# EAGLE schematic MicroBit_Breakout (EAGLE 7.3.0)
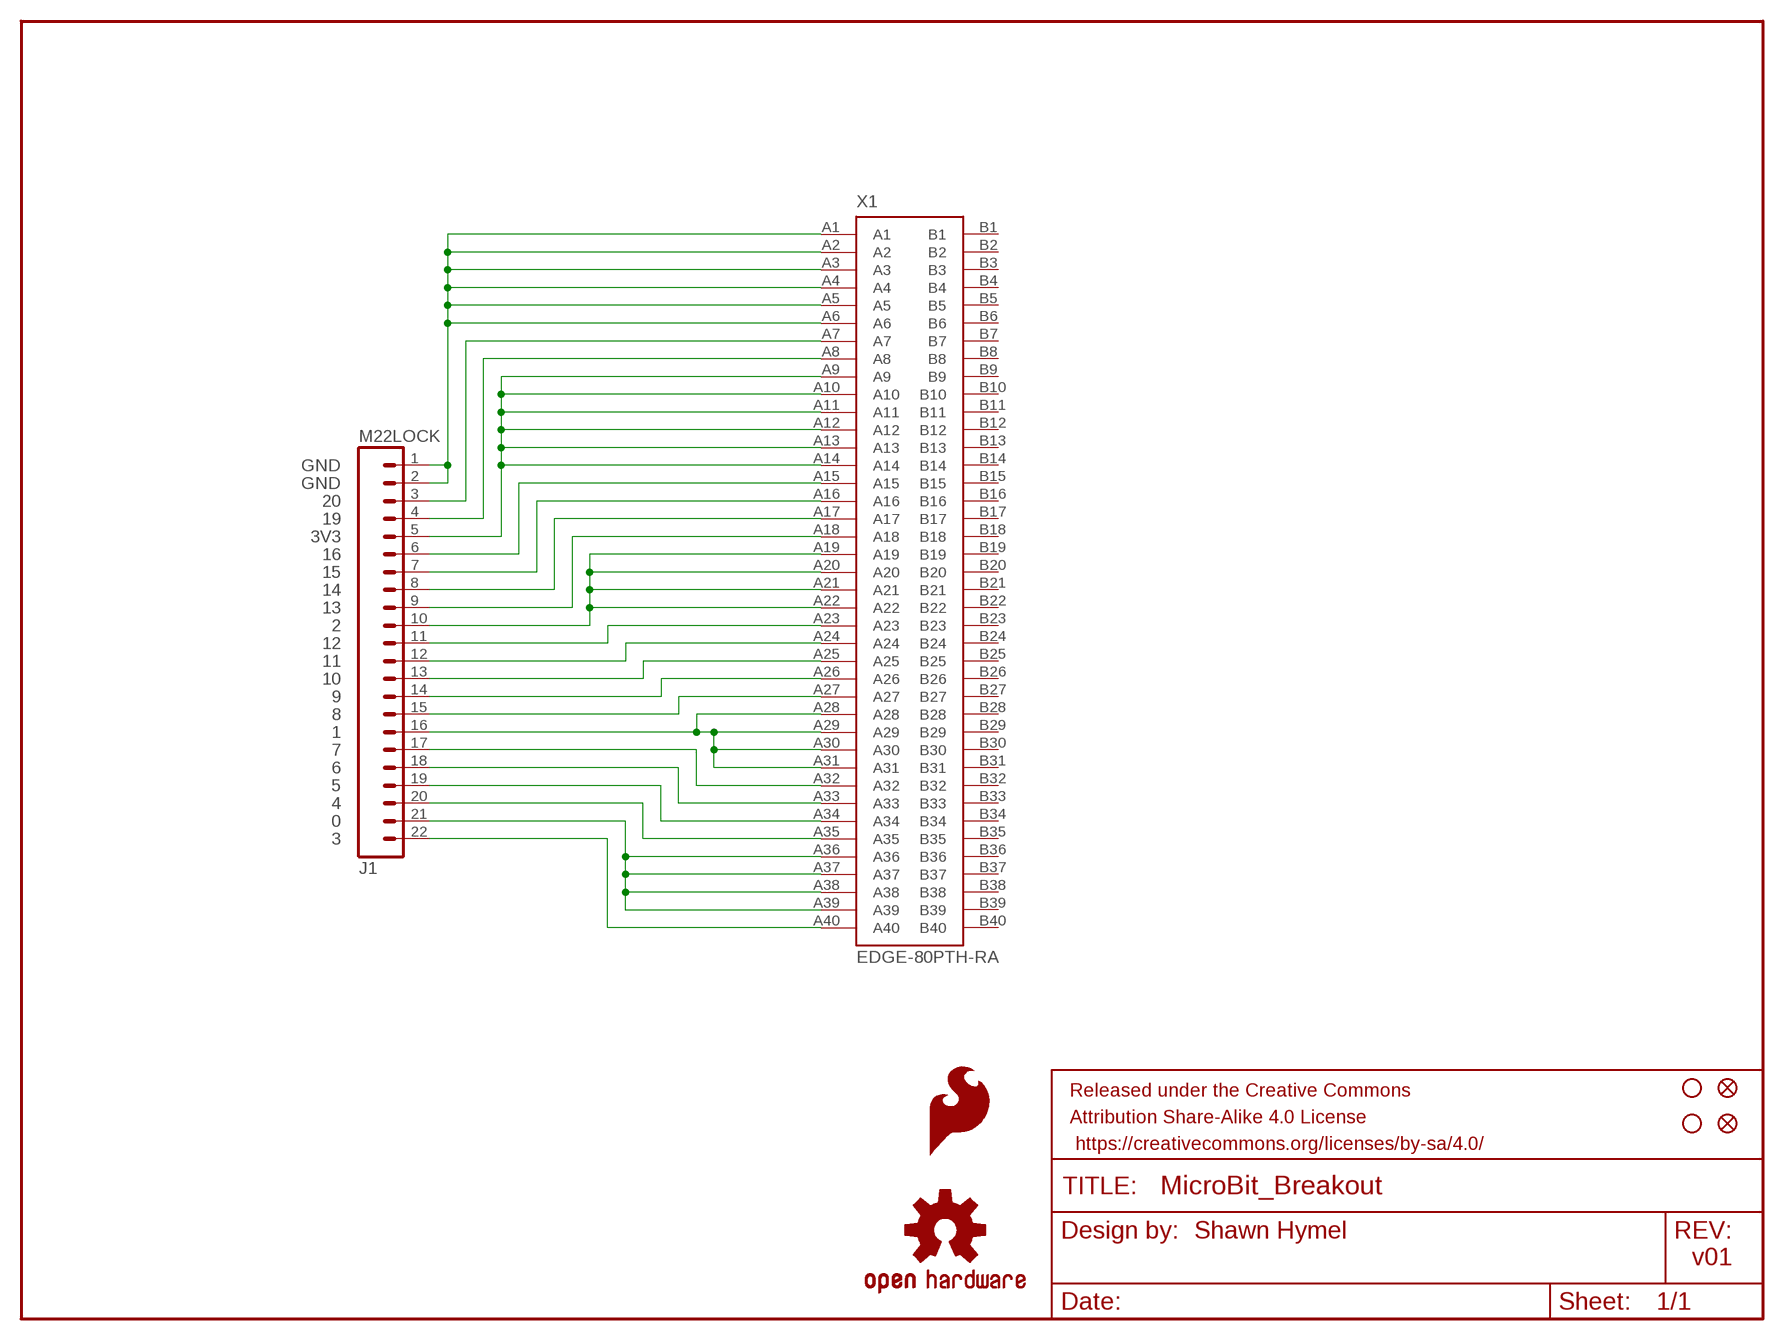
[diagram p0: schematic, sheet 1]

## Parts
FD1  FIDUCIAL1X2  [FIDUCIAL-1X2]
FD2  FIDUCIAL1X2  [FIDUCIAL-1X2]
FRAME1  FRAME-LETTER  [CREATIVE_COMMONS]
H1  STAND-OFF  [STAND-OFF]
H2  STAND-OFF  [STAND-OFF]
J1  M22LOCK  [1X22_LOCK]
LOGO1  SFE_LOGO_FLAME.1_INCH  [SFE_LOGO_FLAME_.1]
LOGO3  OSHW-LOGOS  [OSHW-LOGO-S]
X1  EDGE-80PTH-RA  [VEC-127-080-R]

## Nets
GND: J1.1 J1.2 X1.A1 X1.A2 X1.A3 X1.A4 X1.A5 X1.A6
N$2: J1.6 X1.A15
N$3: J1.3 X1.A7
N$4: J1.4 X1.A8
N$5: J1.5 X1.A9 X1.A10 X1.A11 X1.A12 X1.A13 X1.A14
N$6: J1.7 X1.A16
N$7: J1.8 X1.A17
N$8: J1.9 X1.A18
N$9: J1.10 X1.A19 X1.A20 X1.A21 X1.A22
N$10: J1.11 X1.A23
N$11: J1.12 X1.A24
N$12: J1.13 X1.A25
N$13: J1.14 X1.A26
N$14: J1.15 X1.A27
N$15: J1.16 X1.A28 X1.A29 X1.A30 X1.A31
N$17: J1.17 X1.A32
N$18: J1.18 X1.A33
N$19: J1.19 X1.A34
N$20: J1.20 X1.A35
N$21: J1.21 X1.A36 X1.A37 X1.A38 X1.A39
N$22: J1.22 X1.A40
Unconnected: X1.B1 X1.B2 X1.B3 X1.B4 X1.B5 X1.B6 X1.B7 X1.B8 X1.B9 X1.B10 X1.B11 X1.B12 X1.B13 X1.B14 X1.B15 X1.B16 X1.B17 X1.B18 X1.B19 X1.B20 X1.B21 X1.B22 X1.B23 X1.B24 X1.B25 X1.B26 X1.B27 X1.B28 X1.B29 X1.B30 X1.B31 X1.B32 X1.B33 X1.B34 X1.B35 X1.B36 X1.B37 X1.B38 X1.B39 X1.B40

## Notes on the sheet
- GND
- GND
- 20
- 19
- 3V3
- 16
- 15
- 14
- 13
- 2
- 12
- 11
- 10
- 9
- 8
- 1
- 7
- 6
- 5
- 4
- 0
- 3
- Shawn Hymel
- v01

## Library data of the parts
FD1 FD2 = SparkFun-Aesthetics:FIDUCIAL: Fiducial Alignment Points Various fiducial points for machine vision alignment.
FRAME1 = SparkFun-Aesthetics:FRAME-LETTER: Schematic Frame Standard 8.5x11 US Letter frame
H1 H2 = SparkFun-Electromechanical:STAND-OFF: #4 Stand Off This is the mechanical footprint for a #4 phillips button head screw. Use the keepout ring to avoid running the screw head into surrounding components. SKU : PRT-00447
J1 = SparkFun-Connectors:M22
LOGO1 = SparkFun-Aesthetics:SFE_LOGO_FLAME: SFE Logo, flame only This is the SparkFun flame logo. The logo on the schematic will always be the same size; the package variant is the height of the flame. Default layer for the logo on the board is tSilk.
LOGO3 = SparkFun-Aesthetics:OSHW-LOGO: Open Source Hardware Logo This logo indicates the piece of hardware it is found on incorporates a OSHW license and/or adheres to the definition of open source hardware found here: http://freedomdefined.org/OSHW
X1 = SparkFun-Connectors:EDGE-80: Card edge connector (80 pin) for accepting a PCB with finger edge pins. This connector will accept the micro:bit board.